# EAGLE design nrftx (EAGLE 9.6.0)
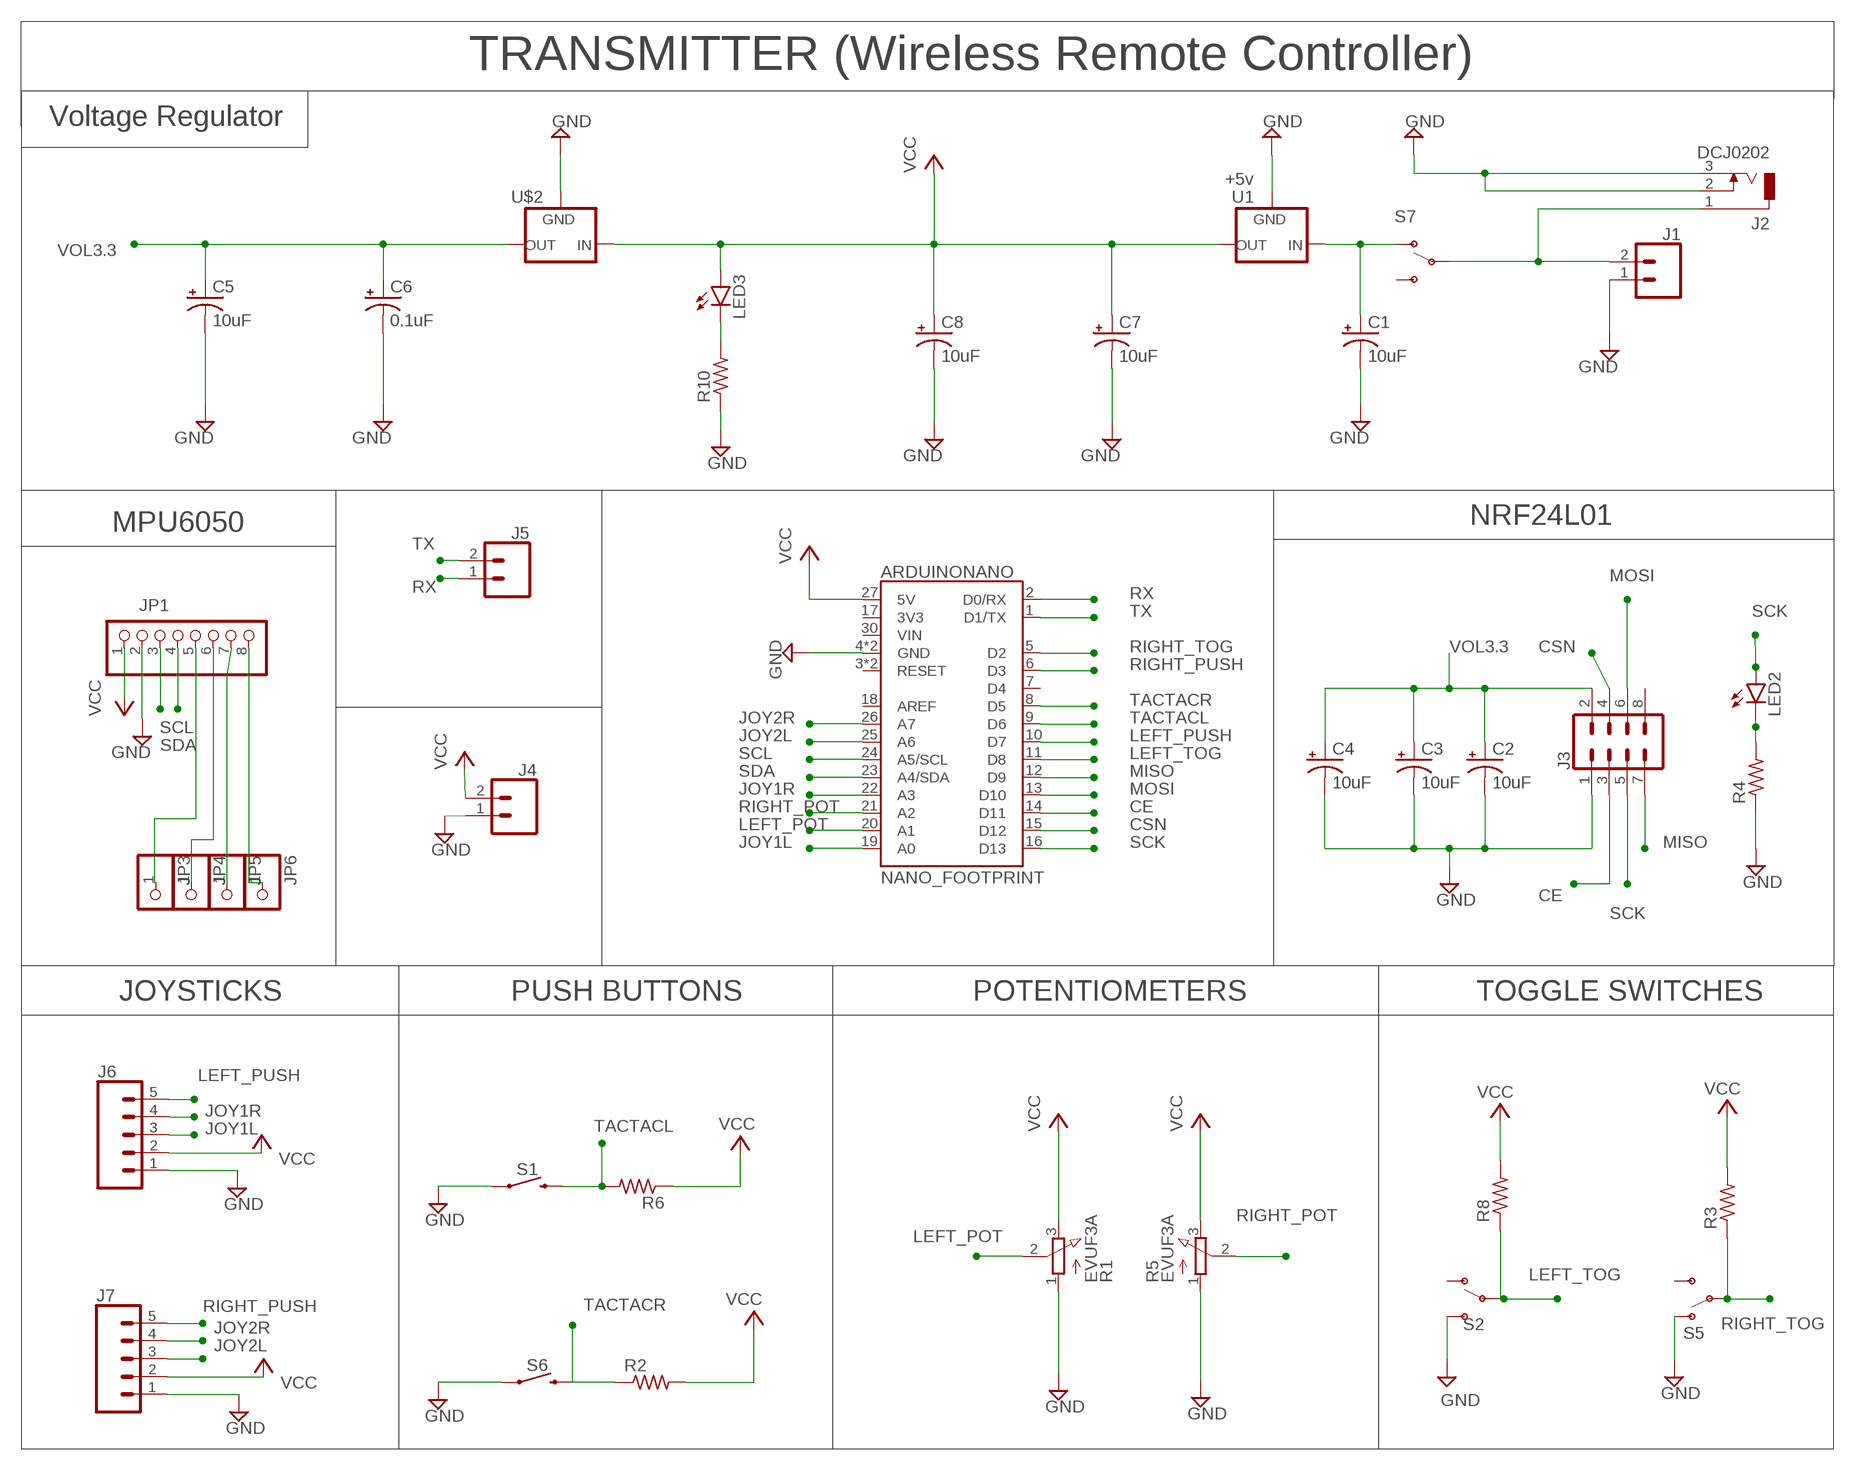
[diagram p0: schematic, sheet 1]

## Parts
ARDUINONANO  NANO_FOOTPRINT  [NANO]
C1  10uF  10UF-POLAR-RADIAL-2.5MM-KIT-25V-20%  [CPOL-RADIAL-2.5MM-5MM-KIT]
C2  10uF  10UF-POLAR-RADIAL-2.5MM-KIT-25V-20%  [CPOL-RADIAL-2.5MM-5MM-KIT]
C3  10uF  10UF-POLAR-RADIAL-2.5MM-KIT-25V-20%  [CPOL-RADIAL-2.5MM-5MM-KIT]
C4  10uF  10UF-POLAR-RADIAL-2.5MM-KIT-25V-20%  [CPOL-RADIAL-2.5MM-5MM-KIT]
C5  10uF  10UF-POLAR-RADIAL-2.5MM-KIT-25V-20%  [CPOL-RADIAL-2.5MM-5MM-KIT]
C6  0.1uF  10UF-POLAR-RADIAL-2.5MM-KIT-25V-20%  [CPOL-RADIAL-2.5MM-5MM-KIT]
C7  10uF  10UF-POLAR-RADIAL-2.5MM-KIT-25V-20%  [CPOL-RADIAL-2.5MM-5MM-KIT]
C8  10uF  10UF-POLAR-RADIAL-2.5MM-KIT-25V-20%  [CPOL-RADIAL-2.5MM-5MM-KIT]
J1  CONN_02  [1X02]
J2  DCJ0202  [DCJ0202]
J3  CONN_04X2  [2X4]
J4  CONN_02  [1X02]
J5  CONN_02  [1X02]
J6  CONN_05PTH  [1X05]
J7  CONN_05PTH  [1X05]
JP1  PINHD-1X8  [1X08]
JP3  PINHD-1X1  [1X01]
JP4  PINHD-1X1  [1X01]
JP5  PINHD-1X1  [1X01]
JP6  PINHD-1X1  [1X01]
LED2  LED5MM  [LED5MM]
LED3  LED5MM  [LED5MM]
R1  EVUF3A  [EVUF]
R2  R-US_M1206  [M1206]
R3  R-US_M1206  [M1206]
R4  R-US_M1206  [M1206]
R5  EVUF3A  [EVUF]
R6  R-US_M1206  [M1206]
R8  R-US_M1206  [M1206]
R10  R-US_M1206  [M1206]
S1  MOMENTARY-SWITCH-SPST-PTH-6.0MM-KIT  [TACTILE_SWITCH_PTH_6.0MM_KIT]
S2  SWITCH-SPDT-PTH-11.6X4.0MM-KIT  [SWITCH_SPDT_PTH_11.6X4.0MM_KIT]
S5  SWITCH-SPDT-PTH-11.6X4.0MM-KIT  [SWITCH_SPDT_PTH_11.6X4.0MM_KIT]
S6  MOMENTARY-SWITCH-SPST-PTH-6.0MM-KIT  [TACTILE_SWITCH_PTH_6.0MM_KIT]
S7  SWITCH-SPDT-PTH-11.6X4.0MM-KIT  [SWITCH_SPDT_PTH_11.6X4.0MM_KIT]
U1  +5v  V_REG_78XX7812  [TO-252]
U$2  V_REG_LD1117VXX  [TO-220-ALT2]

## Nets
CE: ARDUINONANO.14(D11) J3.3
CSN: ARDUINONANO.15(D12) J3.4
GND: ARDUINONANO.4(GND) ARDUINONANO.29(GND) C1.2(-) C2.2(-) C3.2(-) C4.2(-) C5.2(-) C6.2(-) C7.2(-) C8.2(-) J1.1 J2.2 J2.3 J3.1 J4.1 J6.1 J7.1 JP1.2 R1.1(A) R4.1 R5.1(A) R10.1 S1.1 S2.3(S) S5.1(O) S6.1 U1.3(GND) U$2.GND
JOY1L: ARDUINONANO.19(A0) J6.3
JOY1R: ARDUINONANO.22(A3) J6.4
JOY2L: ARDUINONANO.25(A6) J7.3
JOY2R: ARDUINONANO.26(A7) J7.4
LEFT_POT: ARDUINONANO.20(A1) R1.2(S)
LEFT_PUSH: ARDUINONANO.10(D7) J6.5
LEFT_TOG: ARDUINONANO.11(D8) R8.1 S2.2(P)
MISO: ARDUINONANO.12(D9) J3.7
MOSI: ARDUINONANO.13(D10) J3.6
N$1: LED2.K(C) R4.2
N$2: JP1.5 JP3.1
N$3: JP1.6 JP4.1
N$4: JP1.7 JP5.1
N$5: JP1.8 JP6.1
N$13: C1.1(+) S7.1(O) U1.1(IN)
N$14: LED3.K(C) R10.2
N$15: J1.2 J2.1 S7.2(P)
RIGHT_POT: ARDUINONANO.21(A2) R5.2(S)
RIGHT_PUSH: ARDUINONANO.6(D3) J7.5
RIGHT_TOG: ARDUINONANO.5(D2) R3.1 S5.2(P)
RX: ARDUINONANO.2(D0/RX) J5.1
SCK: ARDUINONANO.16(D13) J3.5 LED2.A
SCL: ARDUINONANO.24(A5/SCL) JP1.3
SDA: ARDUINONANO.23(A4/SDA) JP1.4
TACTACL: ARDUINONANO.9(D6) R6.2 S1.3
TACTACR: ARDUINONANO.8(D5) R2.1 S6.3
TX: ARDUINONANO.1(D1/TX) J5.2
VCC: ARDUINONANO.27(5V) C7.1(+) C8.1(+) J4.2 J6.2 J7.2 JP1.1 LED3.A R1.3(E) R2.2 R3.2 R5.3(E) R6.1 R8.2 U1.2(OUT) U$2.IN
VOL3.3: C2.1(+) C3.1(+) C4.1(+) C5.1(+) C6.1(+) J3.2 U$2.OUT
Unconnected: ARDUINONANO.3(RESET) ARDUINONANO.7(D4) ARDUINONANO.17(3V3) ARDUINONANO.18(AREF) ARDUINONANO.28(RESET) ARDUINONANO.30(VIN) J3.8 S2.1(O) S5.3(S) S7.3(S)

## Notes on the sheet
- TRANSMITTER (Wireless Remote Controller)
- Voltage Regulator
- MPU6050 | NRF24L01
- JOYSTICKS | PUSH BUTTONS | POTENTIOMETERS | TOGGLE SWITCHES

## Library data of the parts
ARDUINONANO = SparkFun-Boards:NANO_FOOTPRINT: Generic Nano Footprint
C1-C5 C7 C8 = SparkFun-Capacitors:10UF-POLAR: 10.0µF polarized capacitors A capacitor is a passive two-terminal electrical component used to store electrical energy temporarily in an electric field.; PROD_ID: CAP-08440
C6 = SparkFun-Capacitors:10UF-POLAR: 10.0µF polarized capacitors A capacitor is a passive two-terminal electrical component used to store electrical energy temporarily in an electric field.; PROD_ID: CAP-08440; VALUE: 10uF
J1 J4 J5 = SparkFun-Connectors:CONN_02: Multi connection point. Often used as Generic Header-pin footprint for 0.1 inch spaced/style header connections On any of the 0.1 inch spaced packages, you can populate with these: Break Away Headers - Straight <https://www.sparkfun.com/products/116> (PRT-00116) Break Away Male Headers - Right Angle <https://www.sparkfun.com/products/553> (PRT-00553) Female Headers <https://www.sparkfun.com/products/115> (PRT-00115) Break Away Headers - Machine Pin <https://www.sparkfun.com/products/117> (PRT-00117) Break Away Female Headers - Swiss Machine Pin <https://www.sparkfun.com/products/743> (PRT-00743) For SCREWTERMINALS and SPRING TERMINALS visit here: Screw Terimnals on SparkFun.com <https://www.sparkfun.com/search/results?term=Screw+Terminals> (5mm/3.5mm/2.54mm spacing) This device is also useful as a general connection point to wire up your design to another part of your project. Our various solder wires solder well into these plated through hole pads. Hook-Up Wire - Assortment (Stranded, 22 AWG) <https://www.sparkfun.com/products/11375> (PRT-11375) Hook-Up Wire - Assortment (Solid Core, 22 AWG) <https://www.sparkfun.com/products/11367> (PRT-11367) View the entire wire category on our website here <https://www.sparkfun.com/categories/141> Special notes: Molex polarized connector foot print use with: PRT-08233 with associated crimp pins and housings. 2.54_SCREWTERM for use with PRT-10571. 3.5mm Screw Terminal footprints for PRT-08084 5mm Screw Terminal footprints for use with PRT-08432
J2 = con-jack:DCJ0202: DC POWER JACK Source: DCJ0202.pdf; OC_FARNELL: unknown; OC_NEWARK: unknown
J3 = SparkFun-Connectors:CONN_04X2: Multi connection point. Often used as Generic Header-pin footprint for 0.1 inch spaced/style header connections On any of the 0.1 inch spaced packages, you can populate with these: Break Away Headers - Straight <https://www.sparkfun.com/products/116> (PRT-00116) Break Away Male Headers - Right Angle <https://www.sparkfun.com/products/553> (PRT-00553) Female Headers <https://www.sparkfun.com/products/115> (PRT-00115) Break Away Headers - Machine Pin <https://www.sparkfun.com/products/117> (PRT-00117) Break Away Female Headers - Swiss Machine Pin <https://www.sparkfun.com/products/743> (PRT-00743)
J6 J7 = SparkFun-Connectors:CONN_05: Multi connection point. Often used as Generic Header-pin footprint for 0.1 inch spaced/style header connections On any of the 0.1 inch spaced packages, you can populate with these: Break Away Headers - Straight <https://www.sparkfun.com/products/116> (PRT-00116) Break Away Male Headers - Right Angle <https://www.sparkfun.com/products/553> (PRT-00553) Female Headers <https://www.sparkfun.com/products/115> (PRT-00115) Break Away Headers - Machine Pin <https://www.sparkfun.com/products/117> (PRT-00117) Break Away Female Headers - Swiss Machine Pin <https://www.sparkfun.com/products/743> (PRT-00743) For SCREWTERMINALS and SPRING TERMINALS visit here: Screw Terimnals on SparkFun.com <https://www.sparkfun.com/search/results?term=Screw+Terminals> (5mm/3.5mm/2.54mm spacing) This device is also useful as a general connection point to wire up your design to another part of your project. Our various solder wires solder well into these plated through hole pads. Hook-Up Wire - Assortment (Stranded, 22 AWG) <https://www.sparkfun.com/products/11375> (PRT-11375) Hook-Up Wire - Assortment (Solid Core, 22 AWG) <https://www.sparkfun.com/products/11367> (PRT-11367) View the entire wire category on our website here <https://www.sparkfun.com/categories/141> Special notes: Molex polarized connector foot print use with SKU : PRT-08231 with associated crimp pins and housings. 1MM SMD Version SKU: PRT-10208
JP1 = pinhead:PINHD-1X8: PIN HEADER
JP3-JP6 = pinhead:PINHD-1X1: PIN HEADER
LED2 LED3 = led:LED: LED OSRAM: - CHIPLED LG R971, LG N971, LY N971, LG Q971, LY Q971, LO R971, LY R971 LH N974, LH R974 LS Q976, LO Q976, LY Q976 LO Q996 - Hyper CHIPLED LW Q18S LB Q993, LB Q99A, LB R99A - SideLED LS A670, LO A670, LY A670, LG A670, LP A670 LB A673, LV A673, LT A673, LW A673 LH A674 LY A675 LS A676, LA A676, LO A676, LY A676, LW A676 LS A679, LY A679, LG A679 - Hyper Micro SIDELED® LS Y876, LA Y876, LO Y876, LY Y876 LT Y87S - SmartLED LW L88C, LW L88S LB L89C, LB L89S, LG L890 LS L89K, LO L89K, LY L89K LS L896, LA L896, LO L896, LY L896 - TOPLED LS T670, LO T670, LY T670, LG T670, LP T670 LSG T670, LSP T670, LSY T670, LOP T670, LYG T670 LG T671, LOG T671, LSG T671 LB T673, LV T673, LT T673, LW T673 LH T674 LS T676, LA T676, LO T676, LY T676, LB T676, LH T676, LSB T676, LW T676 LB T67C, LV T67C, LT T67C, LS T67K, LO T67K, LY T67K, LW E67C LS E67B, LA E67B, LO E67B, LY E67B, LB E67C, LV E67C, LT E67C LW T67C LS T679, LY T679, LG T679 LS T770, LO T770, LY T770, LG T770, LP T770 LB T773, LV T773, LT T773, LW T773 LH T774 LS E675, LA E675, LY E675, LS T675 LS T776, LA T776, LO T776, LY T776, LB T776 LHGB T686 LT T68C, LB T68C - Hyper Mini TOPLED® LB M676 - Mini TOPLED Santana® LG M470 LS M47K, LO M47K, LY M47K Source: http://www.osram.convergy.de LUXEON: - LUMILED® LXK2-PW12-R00, LXK2-PW12-S00, LXK2-PW14-U00, LXK2-PW14-V00 LXK2-PM12-R00, LXK2-PM12-S00, LXK2-PM14-U00 LXK2-PE12-Q00, LXK2-PE12-R00, LXK2-PE12-S00, LXK2-PE14-T00, LXK2-PE14-U00 LXK2-PB12-K00, LXK2-PB12-L00, LXK2-PB12-M00, LXK2-PB14-N00, LXK2-PB14-P00, LXK2-PB14-Q00 LXK2-PR12-L00, LXK2-PR12-M00, LXK2-PR14-Q00, LXK2-PR14-R00 LXK2-PD12-Q00, LXK2-PD12-R00, LXK2-PD12-S00 LXK2-PH12-R00, LXK2-PH12-S00 LXK2-PL12-P00, LXK2-PL12-Q00, LXK2-PL12-R00 Source: www.luxeon.com KINGBRIGHT: KA-3528ASYC Source: www.kingbright.com
R1 R5 = pot:EVU: 9 mm Square Rotary Potentiometers Source: Panasonic
R2-R4 R6 R8 R10 = rcl:R-US_: RESISTOR, American symbol; SPICEPREFIX: R
S1 S6 = SparkFun-Switches:MOMENTARY-SWITCH-SPST: Momentary Switch (Pushbutton) - SPST Normally-open (NO) SPST momentary switches (buttons, pushbuttons). Variants PTH-12MM - 12mm square, through-hole Momentary Pushbutton Switch - 12mm Square <https://www.sparkfun.com/products/9190> (COM-09190) PTH-6.0MM, PTH-6.0MM-KIT - 6.0mm square, through-hole Mini Pushbutton Switch <https://www.sparkfun.com/products/97> (COM-00097) KIT package intended for soldering kit's - only one side of pads' copper is exposed. PTH-RIGHT-ANGLE-KIT - Right-angle, through-hole Right Angle Tactile Button <https://www.sparkfun.com/products/10791> - Used on SparkFun BigTime Watch Kit <https://www.sparkfun.com/products/11734> SMD-12MM - 12mm square, surface-mount Tactile Button - SMD (12mm) <https://www.sparkfun.com/products/12993> (COM-12993) Used on SparkFun PicoBoard <https://www.sparkfun.com/products/11888> SMD-4.5MM - 4.5mm Square Trackball Switch Used on SparkFun Blackberry Trackballer Breakout <https://www.sparkfun.com/products/13169> SMD-4.6MMX2.8MM - 4.60mm x 2.80mm, surface mount Used on SparkFun Pro Micro - RP2040 <https://www.sparkfun.com/products/17717> SMD-5.2MM, SMD-5.2-REDUNDANT - 5.2mm square, surface-mount Mini Pushbutton Switch - SMD <https://www.sparkfun.com/products/8720> (COM-08720) Used on Arduino Pro Mini <https://www.sparkfun.com/products/11114> REDUNDANT package connects both switch circuits together SMD-6.0X3.5MM - 6.0 x 3.5mm, surface mount Momentary Reset Switch SMD <https://www.sparkfun.com/products/8229> (COM-08229) SMD-6.2MM-TALL - 6.2mm square, surface mount Tactile Button - SMD (6mm) <https://www.sparkfun.com/products/12992> Used on SparkFun Digital Sandbox <https://www.sparkfun.com/products/12651> SMD-RIGHT-ANGLE - Right-angle, surface mount Used on SparkFun Block for Intel® Edison - Arduino <https://www.sparkfun.com/products/13036>; PROD_ID: SWCH-08441; SF_SKU: COM-00097
S2 S5 S7 = SparkFun-Switches:SWITCH-SPDT: Single Pole, Double Throw (SPDT) Switch Single-pole, double-throw (SPDT) switch. Variant Overview SMD-AYZ0202 Surface Mount DPDT Switch <https://www.sparkfun.com/products/597> (COM-00597) Used on e.g. LilyPad Arduino USB - ATmega32U4 Board <https://www.sparkfun.com/products/12049> PTH-11.6X4.0MM SPDT Mini Power Switch <https://www.sparkfun.com/products/102> (COM-00102) Used on e.g. SparkFun Simon Says - Through-Hole Soldering Kit <https://www.sparkfun.com/products/10547> (KIT-10547) PTH-11.6X4.0MM-KIT KIT version of SPDT Mini Power Switch - Simplifies soldering by removing tStop of switch pins - only one side can be soldered. PTH-11.6X4.0MM-LOCK LOCK version of SPDT Mini Power Switch - Offset pins hold switch in place for easier soldering. SMD-RIGHT-ANGLE Surface Mount Right Angle Switch <https://www.sparkfun.com/products/10860> (COM-10860) Used on e.g. SparkFun ESP8266 Thing <https://www.sparkfun.com/products/13231>; PROD_ID: SWCH-08261; SF_SKU: COM-00102
U1 = SparkFun-IC-Power:V_REG_78XX: Voltage Regulator Standard 78xx regulator. IGO (Input Ground Output). Spark Fun Electronics SKU : COM-00107; PROD_ID: VREG-12370; VALUE: +12v
U$2 = SparkFun-IC-Power:V_REG_LD1117VXX: LD1117VXX voltage regulator. We carry the 3.3V version (COM-00526) in TO-220 package.

## Board
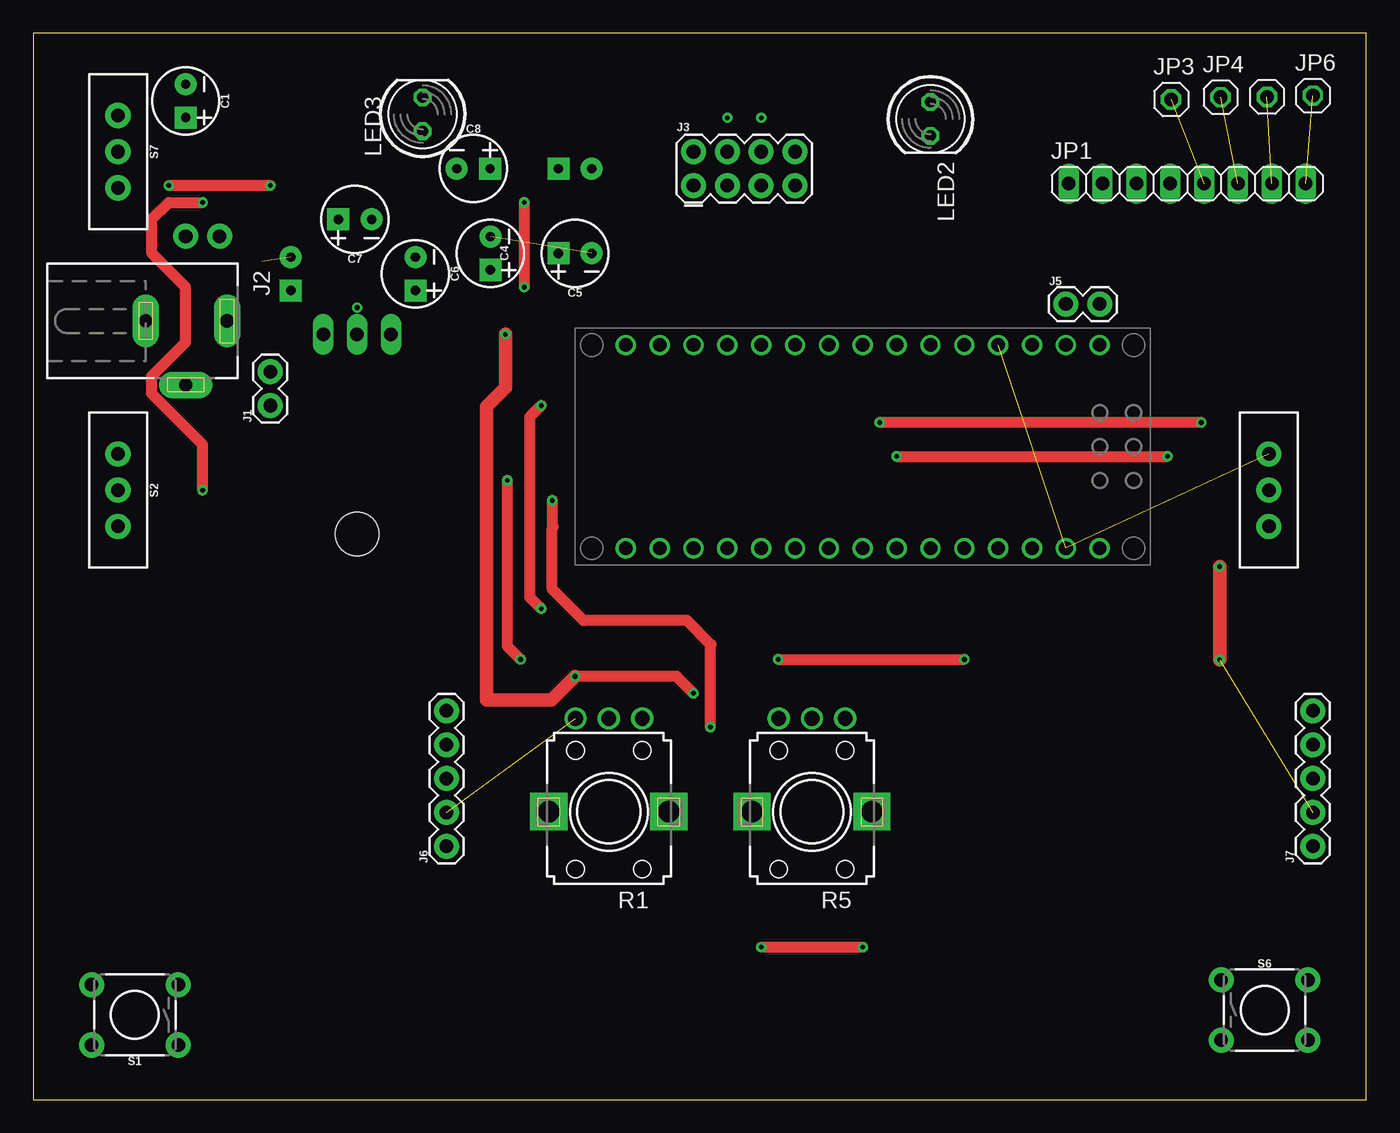
[diagram p1: board, top side]
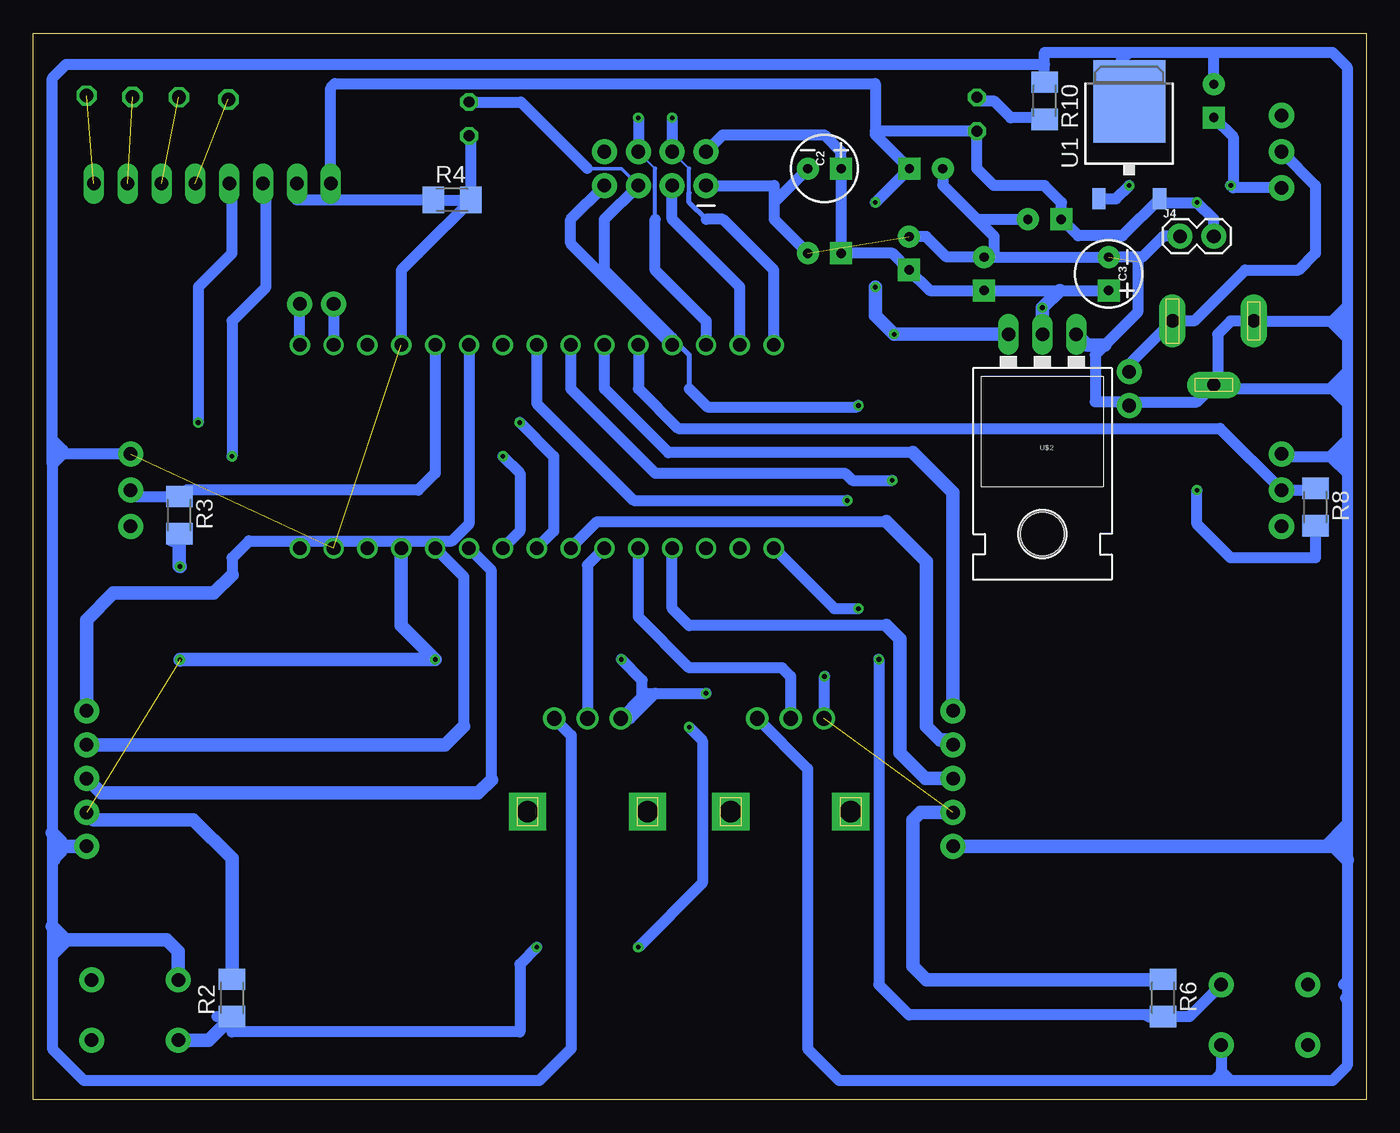
[diagram p2: board, bottom side, seen from below]

Size 100 x 80 mm. Coordinates in mm from the lower left corner, seen from the top.
Outline: 0,0 100,0 100,80 0,80 0,0
Copper layers (1*16): Top 0.035mm / dielectric 1.5mm / Bottom 0.035mm
Design rules "default": minimum track width 6mil, minimum drill 0.35mm, track to track 6mil, track to pad 6mil, pad to pad 6mil, via to via 6mil, smd to smd 6mil, copper to edge 40mil, drill to drill 6mil, minimum pad ring 10mil, minimum via ring 8mil, stop-mask expansion 4mil, vias tented up to drill 0mil, thermal gap 10mil

### Footprints (pad centres in the part's own frame; a part is rotated, then mirrored left to right if it is on the bottom)
NANO = drill 1.016: 1 -7.62,17.78; 2 -7.62,15.24; 3 -7.62,12.7; 4 -7.62,10.16; 5 -7.62,7.62; 6 -7.62,5.08; 7 -7.62,2.54; 8 -7.62,0; 9 -7.62,-2.54; 10 -7.62,-5.08; 11 -7.62,-7.62; 12 -7.62,-10.16; 13 -7.62,-12.7; 14 -7.62,-15.24; 15 -7.62,-17.78; 16 7.62,-17.78; 17 7.62,-15.24; 18 7.62,-12.7; 19 7.62,-10.16; 20 7.62,-7.62; 21 7.62,-5.08; 22 7.62,-2.54; 23 7.62,0; 24 7.62,2.54; 25 7.62,5.08; 26 7.62,7.62; 27 7.62,10.16; 28 7.62,12.7; 29 7.62,15.24; 30 7.62,17.78
CPOL-RADIAL-2.5MM-5MM-KIT = drill 0.7 pad 1.651 square: 1 1.25,0 | drill 0.7 pad 1.651: 2 -1.25,0
1X02 = drill 1.016 pad 1.88: 1 0,0; 2 2.54,0
DCJ0202 = drill 1 pad 2 long: 1 0,3.1; 2 4.8,0; 3 0,-3
2X4 = drill 1.016 pad 1.88: 1 -3.81,-1.27; 2 -3.81,1.27; 3 -1.27,-1.27; 4 -1.27,1.27; 5 1.27,-1.27; 6 1.27,1.27; 7 3.81,-1.27; 8 3.81,1.27
1X05 = drill 1.016 pad 1.88: 1 0,0; 2 2.54,0; 3 5.08,0; 4 7.62,0; 5 10.16,0
1X08 = drill 1.016 long: 1 -8.89,0; 2 -6.35,0; 3 -3.81,0; 4 -1.27,0; 5 1.27,0; 6 3.81,0; 7 6.35,0; 8 8.89,0
1X01 = drill 1.016 octagon: 1 0,0
LED5MM = drill 0.813 octagon: A -1.27,0; K 1.27,0
EVUF = drill 1.1 pad 1.676: 1 -2.5,-7; 2 0,-7; 3 2.5,-7 | drill 1.6 pad 2.8 square: M1 4.5,0; M2 -4.5,0
M1206 = smd 1.6 x 2: 1 -1.4,0; 2 1.4,0
TACTILE_SWITCH_PTH_6.0MM_KIT = drill 1.016 pad 1.88: 1 -3.251,2.261; 2 3.251,2.261; 3 -3.251,-2.261; 4 3.251,-2.261
SWITCH_SPDT_PTH_11.6X4.0MM_KIT = drill 1.016 pad 1.88: 1 0,2.718; 2 0,0; 3 0,-2.718
TO-252 = smd 1 x 1.6: 1 -2.28,-4.8; 2 2.28,-4.8 | smd 5.4 x 6.2: 3 0,2.5
TO-220-ALT2 = drill 1.016 long: GND -2.54,-3.81; IN 2.54,-3.81; OUT 0,-3.81 | hole 3.302: 0,11.176

### Placement (x,y rotation side)
ARDUINONANO  62.23,48.99 270 top
C1  11.43,74.93 270 top
C2  40.64,69.85 0 bottom
C3  19.32,61.96 270 bottom
C4  34.29,63.5 270 top
C5  40.64,63.5 180 top
C6  28.67,61.96 270 top
C7  24.13,66.04 180 top
C8  33.02,69.85 0 top
J1  17.78,52.07 90 top
J2  11.43,58.42 270 top
J3  53.34,69.85 0 top
J4  13.97,64.77 0 bottom
J5  77.47,59.69 0 top
J6  31,19 90 top
J7  96,19 90 top
JP1  86.57,68.72 0 top
JP3  85.37,75.04 0 top
JP4  89.08,75.21 0 top
JP5  92.56,75.24 0 top
JP6  96,75.32 0 top
LED2  67.31,73.58 270 top
LED3  29.21,73.93 90 top
R1  43.18,21.59 180 top
R2  85.09,7.62 90 bottom
R3  89.05,43.84 270 bottom
R4  68.58,67.5 0 bottom
R5  58.42,21.59 180 top
R6  15.24,7.62 270 bottom
R8  3.81,44.45 270 bottom
R10  24.13,74.93 270 bottom
S1  7.62,6.35 180 top
S2  6.35,45.72 180 top
S5  92.71,45.72 0 top
S6  92.38,6.71 0 top
S7  6.35,71.12 180 top
U1  17.78,72.39 0 bottom
U$2  24.29,53.61 180 bottom

### Tracks (layer width: path | path; a pad name or v marks a point on that pad's centre or on a via)
CE
  Bottom 0.813: J3.3 52.07,66.04 46.99,60.96 ARDUINONANO.14
CSN  (via drill 0.35)
  Bottom 0.203: 50.8,69.85 J3.4
  Bottom 0.305: 50.8,67.31 50.8,69.85
  Bottom 0.381: 49.53,66.04 50.8,67.31 50.8,68.04
  Bottom 0.813: ARDUINONANO.15 44.45,62.23 48.26,66.04 49.53,66.04 | v52.07,73.66 J3.4
GND  (4 unrouted)
  Bottom 0.813: 1.42,53.34 1.42,52.22 | 1.42,52.22 1.42,49.53 | 1.42,49.53 1.42,48.26 | 1.42,48.26 1.42,46.99 | 1.42,46.99 1.42,18 1.42,8.89 | 1.42,8.89 1.42,7.62 | 1.42,7.62 1.42,2.54 2.54,1.42 10.16,1.42 | 98.58,47.65 98.58,20 98.58,13 98.58,3.81 96.19,1.42 62.04,1.42 59.65,3.81 59.65,27.32 R5.1 | 98.58,47.65 98.58,48.26 | 98.58,48.26 98.58,48.69 | 98.58,48.69 98.58,49.53 | 98.58,49.53 98.58,76.63 97.55,77.66 24.13,77.66 | 17.78,78.58 24.13,78.58 24.13,77.66 | 17.78,78.58 11.43,78.58 | 11.43,78.58 2.53,78.58 1.42,77.47 1.42,59.54 | 1.42,59.54 1.42,58.42 | 1.42,58.42 1.42,57.15 | 1.42,57.15 1.42,54.61 | 1.42,54.61 1.42,53.34 | 6.17,48.26 S2.3 6.35,48.26 2.54,48.26 | 1.7,8.61 1.42,8.89 | R10.1 24.13,77.66 | 11.15,53.34 J2.2 12.7,52.35 17.5,52.35 J1.1 18.06,52.35 20.32,52.35 20.32,55.88 19.6,56.6 17.14,59.06 17.14,62.85 | 11.15,53.34 2.54,53.34 | 2.54,53.34 1.42,53.34 | 18.88,73.79 18.39,74.28 | 18.39,74.28 U1.3 | C6.2 C3.2 16.78,63.21 15.22,64.77 J4.1 | 29.19,66.04 31.77,68.62 C8.2 | 29.19,66.04 27.92,64.77 27.92,63.21 C6.2 | 29.19,66.04 C7.2 25.4,66.06 | 2.54,48.26 1.42,48.26 | C6.2 31.48,63.21 33.02,64.75 C4.2 | 44.43,67.31 44.43,68.58 J3.1 | 44.43,67.31 44.43,66.04 C5.2 | 44.43,67.31 C2.2 | 97.79,48.44 98.4,48.44 98.58,48.26 | 97.79,48.44 97.79,48.74 98.58,49.53 | 97.79,48.44 98.58,47.65 | ARDUINONANO.4 72.39,62.23 71.12,63.5 67.12,67.5 R4.1 | C1.2 11.43,78.58 | 17.78,78.58 18.39,77.96 18.39,74.28 | R4.1 69.85,67.5 | 1.55,7.62 1.42,7.62 | 1.42,58.42 2.54,58.42 | 2.54,58.42 J2.3 10.16,58.42 11.15,57.43 11.15,53.34 | R1.1 41.91,24.82 41.91,3.81 39.52,1.42 11.43,1.42 | 2.54,48.26 2.54,48.41 1.42,49.53 | 1.42,46.99 2.54,48.11 2.54,48.26
  Bottom 0.813: 2.54,58.42 1.42,59.54 | 1.42,57.15 2.54,58.27 2.54,58.42 | 2.54,53.34 2.54,53.49 1.42,54.61 | 2.54,53.34 1.42,52.22 | 10.16,1.42 11.43,1.42 | S1.1 10.87,2.13 | 10.87,2.13 10.16,1.42 | 10.87,2.13 10.87,1.98 11.43,1.42 | R4.1 80.22,67.5 JP1.2 | S5.1 98.33,48.44 98.58,48.69
  Bottom 1: J6.1 3,19 | 2.42,19 1.52,19 1.52,20.32 | 3,19 1.52,20.48 | 1.42,18 2.42,19 | 2.42,19 3,19 | J7.1 98,19 | 98.48,19 98,19 | S6.1 89.13,11.13 90,12 97.48,12 | 98.48,12 97.58,12 | 98.58,13 97.58,12 | 97.58,12 97.48,12 | 97.48,12 98.48,11 | 98.58,20 98,19.42 98,19 | 98,19 98,18.58 98.48,18.09 98.48,18 | U$2.GND 20.93,56.6 19.6,56.6
JOY1L
  Bottom 0.813: ARDUINONANO.19 52.07,36.83 50.8,35.56 36,35.56
  Bottom 1: J6.3 33.08,24.08 35,26 35,34.56 36,35.56
JOY1R
  Bottom 0.813: ARDUINONANO.22 57.7,43.36 36,43.36
  Bottom 1: J6.4 31.38,27 32,27 33,28 33,40.36 36,43.36
JOY2L
  Bottom 0.813: ARDUINONANO.25 65.62,39.69 65.62,24
  Bottom 1: J7.3 94.92,23 66.62,23 65.62,24
JOY2R
  Bottom 0.813: ARDUINONANO.26 67.72,39.24 67.72,28
  Bottom 1: 67.72,28 69.1,26.62 J7.4
LEFT_POT
  Bottom 0.813: ARDUINONANO.20 54.61,36.21 50.8,32.4 43.83,32.4 43.18,31.75 R1.2
LEFT_PUSH
  Bottom 0.813: ARDUINONANO.10 57.15,53.34 52.35,48.54 34,48.54
  Bottom 1: J6.5 31,45.54 34,48.54
LEFT_TOG
  Bottom 0.813: R8.1 3.94,45.72 S2.2 10.97,50.34 51.61,50.34 54.61,53.34 ARDUINONANO.11
MISO
  Bottom 0.813: J3.7 59.69,66.04 59.69,64.23 ARDUINONANO.12
MOSI  (via drill 0.35)
  Bottom 0.203: 53.34,69.85 J3.6
  Bottom 0.305: 53.34,66.04 53.34,69.85
  Bottom 0.813: ARDUINONANO.13 49.53,58.42 53.34,62.23 53.34,66.04 | v54.61,73.66 J3.6
N$1
  Bottom 0.813: LED2.K 67.18,72.18 R4.2
N$2  (1 unrouted)
N$3  (1 unrouted)
N$4  (1 unrouted)
N$5  (1 unrouted)
N$13  (via drill 0.35)
  Top 0.813: v17.78,68.58 v10.16,68.58
  Bottom 0.813: S7.1 9.98,68.4 | 9.98,68.4 v10.16,68.58 | v17.78,68.58 18.77,67.59 U1.1 | C1.1 9.98,72.23 9.98,68.4
N$14
  Bottom 0.813: R10.2 24.26,73.66 26.67,73.66 27.94,74.93 28.94,74.93 LED3.K
N$15
  Bottom 0.813: S7.2 3.81,68.58 3.81,63.5 5.06,62.25 9.08,62.25 12.9,58.42 J2.1 17.78,55.17 J1.2
RIGHT_POT
  Bottom 0.813: ARDUINONANO.21 58.42,40.1 R5.2
RIGHT_PUSH
  Bottom 0.813: ARDUINONANO.6 67.31,43.18 68.58,41.91 83.82,41.91 85.09,40.64 85.09,39.37
  Bottom 1: 85.09,39.37 86.46,38 94,38 96,36 J7.5
RIGHT_TOG
  Bottom 0.813: ARDUINONANO.5 69.85,46.99 71.12,45.72 88.57,45.72 R3.1 92.23,45.24 S5.2
RX
  Bottom 0.813: J5.1 ARDUINONANO.2
SCK  (via drill 0.35)
  Top 0.813: v38.1,52.07 37.24,51.21 37.24,37.69 v38.1,36.83
  Bottom 0.254: 58.42,69.85 55.88,69.85 J3.5
  Bottom 0.381: 53.34,58.42 52.07,57.15 50.8,55.88 50.8,53.34
  Bottom 0.813: 50.8,53.34 49.43,51.97 38.2,51.97 v38.1,52.07 | LED2.A 63.42,74.85 58.42,69.85 | J3.5 57.15,66.04 57.15,62.23 52.07,57.15 | ARDUINONANO.16 39.91,36.83 v38.1,36.83
SCL  (via drill 0.35)
  Top 0.813: v64.77,48.26 v85.09,48.26
  Bottom 0.813: ARDUINONANO.24 63.5,42.64 63.5,46.99 v64.77,48.26 | v85.09,48.26 85.09,58.42 82.55,60.96 82.55,68.51 JP1.3
SDA  (via drill 0.35)
  Top 0.813: v87.63,50.8 v63.5,50.8
  Bottom 0.813: v63.5,50.8 60.96,48.26 60.96,42.64 ARDUINONANO.23 | v87.63,50.8 87.63,60.96 85.09,63.5 85.09,68.51 JP1.4
TACTACL  (via drill 0.35)
  Top 0.813: v35.56,46.45 35.56,34.02 v36.56,33.02
  Bottom 0.813: R6.2 15.37,6.35 | 15.24,6.35 16.51,6.35 | 16.51,6.35 34.29,6.35 36.56,8.62 v36.56,33.02 | ARDUINONANO.9 59.69,53.34 53.35,47 39.11,47 38.56,46.45 v35.56,46.45 | 16.51,6.35 16.38,6.22 R6.2 | S1.3 13.26,6.22 R6.2
TACTACR  (via drill 0.35)
  Top 0.813: v62.23,11.43 v54.61,11.43 | v50.8,27.94 50.8,34.05 50.86,34.11 | 50.86,34.11 | 50.86,34.11 49.03,35.95 41.34,35.95 41.3,35.91 38.92,38.29 38.92,42.88 39.01,42.97 38.93,43.05 v38.93,44.95
  Bottom 0.813: v54.61,11.43 49.8,16.24 49.8,26.94 v50.8,27.94 | ARDUINONANO.8 62.23,52.22 54.96,44.95 v38.93,44.95 | v62.23,11.43 63.5,10.16 63.5,5.08 85.09,5.08 R2.1 86.23,6.22
  Bottom 1: S6.3 86.86,4.45 R2.1
TX
  Bottom 0.813: ARDUINONANO.1 J5.2
VCC  (via drill 0.35)  (2 unrouted)
  Top 0.813: v36.83,67.31 v36.83,60.96 | v55.88,33.02 v69.85,33.02 | v49.53,30.48 48.26,31.75 v40.64,31.75 | v12.7,45.72 12.7,49.15 8.87,52.97 8.87,54.27 11.43,56.82 11.43,60.96 8.89,63.5 8.89,66.04 10.16,67.31 v12.7,67.31
  Top 1: v89,40 v89,33 | v35.42,57.42 35.42,53.42 34,52 34,30 38.89,30 v40.64,31.75
  Bottom 0.813: R8.2 3.81,40.64 10.16,40.64 12.7,43.18 v12.7,45.72 | JP1.1 77.68,75.91 77.38,76.22 36.83,76.22 36.83,72.66 | 54.32,30.19 R5.3 55.23,28.59 53.34,30.48 | 54.32,30.19 54.03,30.48 53.34,30.48 | 53.34,30.48 v49.53,30.48 | 36.83,72.66 36.83,72.41 C8.1 36.81,67.31 v36.83,67.31 | 22.86,66.06 22.86,67.31 24.13,68.58 27.94,68.58 29.21,69.85 LED3.A 36.83,72.66 | 22.86,66.06 C7.1 | 54.32,30.19 54.32,31.46 v55.88,33.02 | R1.3 40.64,28.63 v40.64,31.75 | J4.2 11.43,66.04 v12.7,67.31 15.22,67.31 U1.2 18.29,64.8 21.6,64.8 22.86,66.06 | 89.59,41.9 R3.2
  Bottom 1: J6.2 33.46,21.54 34,21 34,10 33,9 15.26,9 R6.1 | J7.2 95.46,21 88,21 85.09,18.09 R2.2 | ARDUINONANO.27 72.39,35.56 v69.85,33.02 88.98,33.02 v89,33 | R3.2 89.05,40.05 v89,40 | U$2.IN v35.42,57.42 36.83,58.83 v36.83,60.96
VOL3.3  (via drill 0.35)
  Bottom 0.813: C3.1 23,60.71 C6.1 32.75,60.71 C4.1 35.54,63.5 C5.1 C2.1 39.39,71.12 40.66,72.39 48.26,72.39 J3.2
  Bottom 1: U$2.OUT v24.29,59.42 23,60.71